# Altium project MCU063A.PrjPcb (part 5 of 5)

## Sheet MCU063A_Emulator.SchDoc
size 431 x 279 mm; Date: Not shown in title block; ApprovedBy: Not shown in title block; CheckedBy: Not shown in title block; Author: Not shown in title block; CompanyName: Not shown in title block; DrawnBy: Cody Watkins; Engineer: Not shown in title block; Organization: Not shown in title block; Address1: Not shown in title block; Address2: Not shown in title block; Address3: Not shown in title block; Address4: Not shown in title block; DocumentNumber: 9; Revision: Use project parameter SCH_Rev; SheetNumber: 9; SheetTotal: 11; PageSetup: Record=PageOptions|CenterHorizontal=True|CenterVertical=True|PrintScale=1.00|XCorrection=1.00|YCorrection=1.00|PrintKind=0|BorderSize=5000000|LeftOffset=0|BottomOffset=0|Orientation=2|PaperLength=1000|PaperWidth=1000|Scale=100|PaperSource=15|PrintQuality=600|MediaType=1|DitherType=10|PaperKind=Letter|PrintScaleMode=1; CurrentTime: Not shown in title block; CurrentDate: Not shown in title block; Time: Not shown in title block; DocumentFullPathAndName: Not shown in title block; DocumentName: Not shown in title block; ModifiedDate: Not shown in title block; ImagePath: Not shown in title block
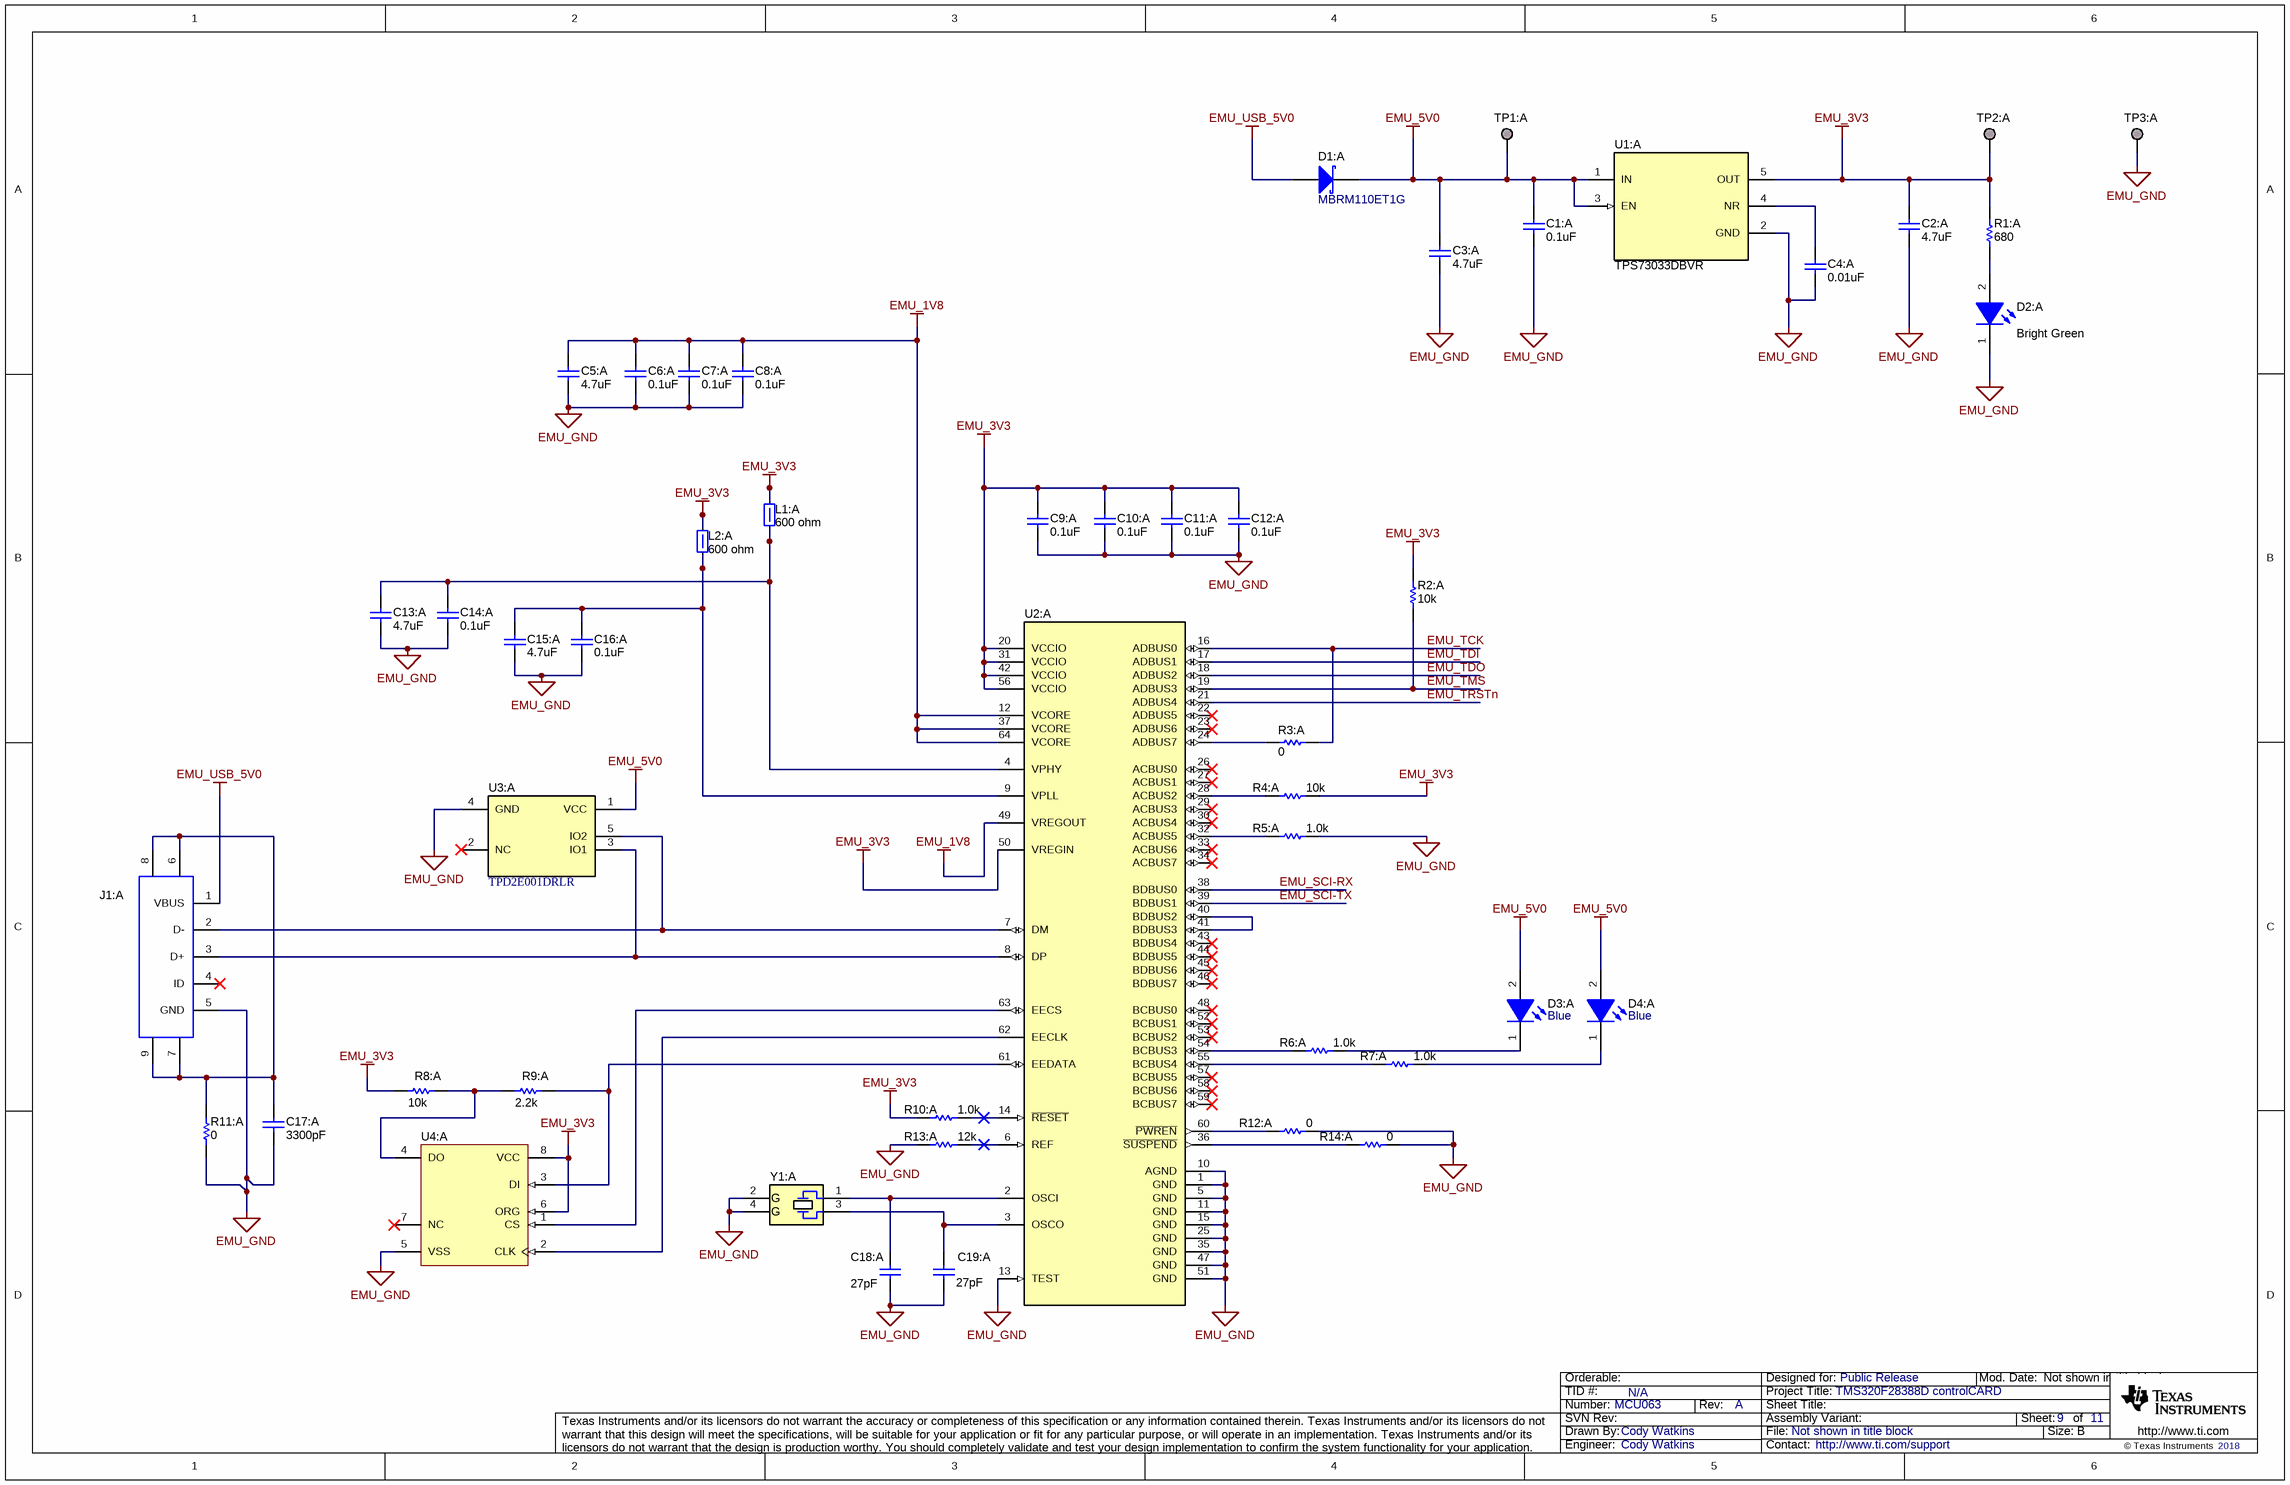
[diagram p8: MCU063A_Emulator.SchDoc]

### Parts
C1:A  ValueDisplayed: 0.1uF  [0402]  (hidden comment: CL05B104KP5NNNC)
C2:A  ValueDisplayed: 4.7uF  [0603]  (hidden comment: C0603C475K9PACTU)
C3:A  ValueDisplayed: 4.7uF  [0603]  (hidden comment: C0603C475K9PACTU)
C4:A  ValueDisplayed: 0.01uF  [0402]  (hidden comment: 0402ZC103KAT2A)
C5:A  ValueDisplayed: 4.7uF  [0603]  (hidden comment: C0603C475K9PACTU)
C6:A  ValueDisplayed: 0.1uF  [0402]  (hidden comment: CL05B104KP5NNNC)
C7:A  ValueDisplayed: 0.1uF  [0402]  (hidden comment: CL05B104KP5NNNC)
C8:A  ValueDisplayed: 0.1uF  [0402]  (hidden comment: CL05B104KP5NNNC)
C9:A  ValueDisplayed: 0.1uF  [0402]  (hidden comment: CL05B104KP5NNNC)
C10:A  ValueDisplayed: 0.1uF  [0402]  (hidden comment: CL05B104KP5NNNC)
C11:A  ValueDisplayed: 0.1uF  [0402]  (hidden comment: CL05B104KP5NNNC)
C12:A  ValueDisplayed: 0.1uF  [0402]  (hidden comment: CL05B104KP5NNNC)
C13:A  ValueDisplayed: 4.7uF  [0603]  (hidden comment: C0603C475K9PACTU)
C14:A  ValueDisplayed: 0.1uF  [0402]  (hidden comment: CL05B104KP5NNNC)
C15:A  ValueDisplayed: 4.7uF  [0603]  (hidden comment: C0603C475K9PACTU)
C16:A  ValueDisplayed: 0.1uF  [0402]  (hidden comment: CL05B104KP5NNNC)
C17:A  ValueDisplayed: 3300pF  [0402]  (hidden comment: CGA2B2X7R1H332K050BA)
C18:A  ValueDisplayed: 27pF  [0402]  (hidden comment: C0402C270J5GACTU)
C19:A  ValueDisplayed: 27pF  [0402]  (hidden comment: C0402C270J5GACTU)
D1:A  MBRM110ET1G  [POWERMITE]
D2:A  value Bright Green  [WL-SMCW_Green_0805]  (hidden comment: 150080VS75000)
D3:A  value Blue  [WL-SMCW_Blue_0805]  (hidden comment: 150080BS75000)
D4:A  value Blue  [WL-SMCW_Blue_0805]  (hidden comment: 150080BS75000)
J1:A  65100516121  [Wurth_65100516121]  (value not drawn)
L1:A  value 600 ohm  [0805_HV]  (hidden comment: HZ0805E601R-10)
L2:A  value 600 ohm  [0805_HV]  (hidden comment: HZ0805E601R-10)
R1:A  ValueDisplayed: 680  [0402]  (hidden comment: CRCW0402680RJNED)
R2:A  ValueDisplayed: 10k  [0402]  (hidden comment: CRCW040210K0JNED)
R3:A  ValueDisplayed: 0  [0402]  (hidden comment: CRCW04020000Z0ED)
R4:A  ValueDisplayed: 10k  [0402]  (hidden comment: CRCW040210K0JNED)
R5:A  ValueDisplayed: 1.0k  [0402]  (hidden comment: CRCW04021K00JNED)
R6:A  ValueDisplayed: 1.0k  [0402]  (hidden comment: CRCW04021K00JNED)
R7:A  ValueDisplayed: 1.0k  [0402]  (hidden comment: CRCW04021K00JNED)
R8:A  ValueDisplayed: 10k  [0402]  (hidden comment: CRCW040210K0JNED)
R9:A  ValueDisplayed: 2.2k  [0402]  (hidden comment: CRCW04022K20JNED)
R10:A  ValueDisplayed: 1.0k  [0402]  (hidden comment: CRCW04021K00JNED)
R11:A  ValueDisplayed: 0  [0402]  (hidden comment: CRCW04020000Z0ED)
R12:A  ValueDisplayed: 0  [0402]  (hidden comment: CRCW04020000Z0ED)
R13:A  ValueDisplayed: 12k  [0402]  (hidden comment: CRCW040212K0JNED)
R14:A  ValueDisplayed: 0  [0402]  (hidden comment: CRCW04020000Z0ED)
TP1:A  TESTPOINT  [TP_50MIL-25MILHOLE]  (value not drawn)  (no BOM)
TP2:A  TESTPOINT  [TP_50MIL-25MILHOLE]  (value not drawn)  (no BOM)
TP3:A  TESTPOINT  [TP_50MIL-25MILHOLE]  (value not drawn)  (no BOM)
U1:A  TPS73033DBVR  [DBV0005A_N]
U2:A  FT2232HL-REEL  [LQFP64_N]  (value not drawn)
U3:A  TPD2E001DRLR  [DRL0005A]
U4:A  93LC56C-I/SN  [SOIC-8]  (value not drawn)
Y1:A  ECS-120-20-30B-TR  [ECS_ECX-53B]  (value not drawn)

### Nets
EMU_1V8: C5:A.2 C6:A.2 C7:A.2 C8:A.2 U2:A.12(VCORE) U2:A.37(VCORE) U2:A.49(VREGOUT) U2:A.64(VCORE)
EMU_3V3: C2:A.1 C9:A.2 C10:A.2 C11:A.2 C12:A.2 L1:A.2 L2:A.2 R1:A.1 R2:A.2 R4:A.2 R8:A.1 R10:A.1 TP2:A.1 U1:A.5(OUT) U2:A.20(VCCIO) U2:A.31(VCCIO) U2:A.42(VCCIO) U2:A.50(VREGIN) U2:A.56(VCCIO) U4:A.6(ORG) U4:A.8(VCC)
EMU_5V0: C1:A.2 C3:A.1 D1:A.1(K) D3:A.2(A) D4:A.2(A) TP1:A.1 U1:A.1(IN) U1:A.3(EN) U3:A.1(VCC)
EMU_GND: C1:A.1 C2:A.2 C3:A.2 C4:A.1 C5:A.1 C6:A.1 C7:A.1 C8:A.1 C9:A.1 C10:A.1 C11:A.1 C12:A.1 C13:A.2 C14:A.1 C15:A.2 C16:A.1 C17:A.1 C18:A.1 C19:A.1 D2:A.1(K) J1:A.5(GND) R5:A.2 R11:A.2 R12:A.1 R13:A.1 R14:A.1 TP3:A.1 U1:A.2(GND) U2:A.1(GND) U2:A.5(GND) U2:A.10(AGND) U2:A.11(GND) U2:A.13(TEST) U2:A.15(GND) U2:A.25(GND) U2:A.35(GND) U2:A.47(GND) U2:A.51(GND) U3:A.4(GND) U4:A.5(VSS) Y1:A.2(GND) Y1:A.4(GND)
EMU_USB_5V0: D1:A.2(A) J1:A.1(VBUS)
EMU_SCI-RX: U2:A.38(BDBUS0)
EMU_SCI-TX: U2:A.39(BDBUS1)
EMU_TCK: R3:A.1 U2:A.16(ADBUS0)
EMU_TDI: U2:A.17(ADBUS1)
EMU_TDO: U2:A.18(ADBUS2)
EMU_TMS: R2:A.1 U2:A.19(ADBUS3)
EMU_TRSTn: U2:A.21(ADBUS4)
NetC4:A_2: C4:A.2 U1:A.4(NR)
NetC13:A_1: C13:A.1 C14:A.2 L1:A.1 U2:A.4(VPHY)
NetC15:A_1: C15:A.1 C16:A.2 L2:A.1 U2:A.9(VPLL)
NetC17:A_2: C17:A.2 J1:A.6 J1:A.7 J1:A.8 J1:A.9 R11:A.1
NetC18:A_2: C18:A.2 U2:A.2(OSCI) Y1:A.1
NetC19:A_2: C19:A.2 U2:A.3(OSCO) Y1:A.3
NetD2:A_2: D2:A.2(A) R1:A.2
NetD3:A_1: D3:A.1(K) R6:A.2
NetD4:A_1: D4:A.1(K) R7:A.2
NetJ1:A_2: J1:A.2(D-) U2:A.7(DM) U3:A.5(IO2)
NetJ1:A_3: J1:A.3(D+) U2:A.8(DP) U3:A.3(IO1)
NetR3:A_2: R3:A.2 U2:A.24(ADBUS7)
NetR4:A_1: R4:A.1 U2:A.28(ACBUS2)
NetR5:A_1: R5:A.1 U2:A.32(ACBUS5)
NetR6:A_1: R6:A.1 U2:A.54(BCBUS3)
NetR7:A_1: R7:A.1 U2:A.55(BCBUS4)
NetR8:A_2: R8:A.2 R9:A.1 U4:A.4(DO)
NetR9:A_2: R9:A.2 U2:A.61(EEDATA) U4:A.3(DI)
NetR10:A_2: R10:A.2 U2:A.14(~{RESET})
NetR12:A_2: R12:A.2 U2:A.60(~{PWREN})
NetR13:A_2: R13:A.2 U2:A.6(REF)
NetR14:A_2: R14:A.2 U2:A.36(~{SUSPEND})
NetU2:A_40: U2:A.40(BDBUS2) U2:A.41(BDBUS3)
NetU2:A_62: U2:A.62(EECLK) U4:A.2(CLK)
NetU2:A_63: U2:A.63(EECS) U4:A.1(CS)

Not connected (* = marked no-connect by the designer): J1:A 4(ID)*; U2:A 22(ADBUS5)* 23(ADBUS6)* 26(ACBUS0)* 27(ACBUS1)* 29(ACBUS3)* 30(ACBUS4)* 33(ACBUS6)* 34(ACBUS7)* 43(BDBUS4)* 44(BDBUS5)* 45(BDBUS6)* 46(BDBUS7)* 48(BCBUS0)* 52(BCBUS1)* 53(BCBUS2)* 57(BCBUS5)* 58(BCBUS6)* 59(BCBUS7)*; U3:A 2(NC)*; U4:A 7(NC)*

### Notes on the sheet
- Drawn By:
- SVN Rev:
- Number:
- TID #:
- Orderable:
- Rev:
- Sheet Title:
- File:
- Project Title:
- Designed for:
- Assembly Variant:
- Mod. Date:
- Sheet:
- Size:
- of
- B
- http://www.ti.com
- Texas Instruments and/or its licensors do not warrant the accuracy or completeness of this specification or any information contained therein. Texas Instruments and/or its licensors do not warrant that this design will meet the specifications, will be suitable for your application or fit for any particular purpose, or will operate in an implementation. Texas Instruments and/or its licensors do not warrant that the design is production worthy. You should completely validate and test your design implementation to confirm the system functionality for your application.
- Engineer:
- Contact:
- © Texas Instruments
- (in symbol CMP-0004646-3) G

### Library data of the parts
C1:A C6:A C7:A C8:A C9:A C10:A C11:A C12:A C14:A C16:A = CMP-0006343-2: CAP, CERM, 0.1 uF, 10 V, +/- 10%, X7R, 0402; Manufacturer: Samsung Electro-Mechanics; Polarized: N; Value: 0.1uF; U/M: EA; Cap_F: 100nF; Value1: Unknown; VDC_V: 10V; TaMin_C: -55°C; TaMax_C: 125°C; AEC Category: Q200; SizeArea_mm2: 0.5; SizeAreaWB_mm2: 3; SizeX_mm: 1; SizeZ_mm: 0.6; CompType: Capacitor; PartNumber: CL05B104KP5NNNC; PackageReference: 0402; RoHS: Y; Tolerance_%: 10%; Value2: 10V; MountType: SMT; Technology: Ceramic; TempCo: X7R; Cap_Case: 0402; Published: 2008-06-19; Publisher: Texas Instruments; LatestRevisionDate: 2017-03-09; ComponentLink1Description: Datasheet link; ComponentLink1URL: http://www.samsungsem.com/kr/front/downloadcms.do?path=/kr/support/product-search/mlcc/__icsFiles/afieldfile/2014/11/05&fileName=S_CL05B104KP5NNNC.pdf; AEC Qualified: N; AEC Grade: N/A; SizeY_mm: 0.5
C2:A C3:A C5:A C13:A C15:A = CMP-0006950-5: CAP, CERM, 4.7 uF, 6.3 V, +/- 10%, X5R, 0603; Manufacturer: Kemet; TaMin_C: -55°C; ESR_ohm: 6m; Polarized: N; SizeAreaWB_mm2: 4.68; Value1: 0.006 ohm; U/M: EA; Value: 4.7uF; TaMax_C: 85°C; SizeZ_mm: 1; SizeX_mm: 1.6; SizeY_mm: 0.8; Value2: 6.3V; SizeArea_mm2: 1.28; Cap_F: 4.7µF; IRMS_A: 7.24A; AEC Category: Q200; Supplier Part Number 2: 80-C0603C475K9P; Publisher: Texas Instruments; Supplier 2: Mouser; Supplier Part Number 3: 9227784; TempCo: X5R; Supplier 3: Farnell; Published: 2008-06-19; RoHS: Y; MountType: SMT; Supplier 1: Digi-Key; PackageReference: 0603; Tolerance_%: 10%; Cap_Case: 0603; CompType: Capacitor; LatestRevisionDate: 2017-03-09; PartNumber: C0603C475K9PACTU; AEC Qualified: ?; ComponentLink1Description: Datasheet link; Supplier Part Number 1: 399-3482-1-ND; Technology: Ceramic; ComponentLink1URL: http://www.kemet.com/kemet/web/homepage/kechome.nsf/vapubfiles/F3102_Y5V.pdf/$file/F3102_Y5V.pdf
C4:A = CMP-0006203-2: CAP, CERM, 0.01 uF, 10 V, +/- 10%, X7R, 0402; Manufacturer: AVX; Polarized: N; Value: 0.01uF; U/M: EA; Cap_F: 10nF; Value1: Unknown; Value2: 10V; TaMin_C: -55°C; TaMax_C: 125°C; AEC Category: Q200; SizeArea_mm2: 0.5; SizeAreaWB_mm2: 3; SizeX_mm: 1; SizeZ_mm: 0.6; CompType: Capacitor; PartNumber: 0402ZC103KAT2A; PackageReference: 0402; RoHS: Y; Tolerance_%: 10%; MountType: SMT; Technology: Ceramic; TempCo: X7R; Cap_Case: 0402; Published: 2008-06-19; Publisher: Texas Instruments; LatestRevisionDate: 2017-03-09; ComponentLink1Description: Datasheet link; ComponentLink1URL: http://datasheets.avx.com/X7RDielectric.pdf; Supplier 1: Digi-Key; Supplier Part Number 1: 478-7890-1-ND; Supplier 2: Newark; Supplier Part Number 2: 94W2829; Supplier 3: Mouser; Supplier Part Number 3: 581-0402ZC103KAT2A; AEC Qualified: N; AEC Grade: N/A; SizeY_mm: 0.5
C17:A = CMP-0006319-2: CAP, CERM, 3300 pF, 50 V, +/- 10%, X7R, AEC-Q200 Grade 1, 0402; Manufacturer: TDK; TaMin_C: -55°C; ESR_ohm: 7.85178d; Polarized: N; SizeAreaWB_mm2: 3; Value1: 0.785178 ohm; U/M: EA; Value: 3300pF; TaMax_C: 125°C; SizeZ_mm: 0.6; SizeX_mm: 1; SizeY_mm: 0.5; Value2: 50V; AEC Qualified: Y; Cap_F: 3.3nF; IRMS_A: 2.72902dA; AEC Category: Q200; Supplier Part Number 2: 810-CGA2B2X7R1H332K050BA; Publisher: Texas Instruments; Supplier 2: Mouser; TempCo: X7R; Published: 2008-06-19; RoHS: Y; MountType: SMT; Supplier 1: Digi-Key; PackageReference: 0402; Tolerance_%: 10%; Cap_Case: 0402; SizeArea_mm2: 0.5; CompType: Capacitor; LatestRevisionDate: 2017-03-09; PartNumber: CGA2B2X7R1H332K050BA; ComponentLink1Description: Datasheet link; AEC Grade: 1; Supplier Part Number 1: 445-6891-1-ND; Technology: Ceramic; ComponentLink1URL: https://product.tdk.com/en/search/capacitor/ceramic/mlcc/info?part_no=CGA2B2X7R1H332K050BA
C18:A C19:A = CMP-0750098-1: CAP, CERM, 27 pF, 50 V,+/- 5%, C0G/NP0, 0402; Manufacturer: Kemet; SizeX_mm: 1; TaMin_C: -55°C; Value: 27pF; Polarized: N; SizeAreaWB_mm2: 3; SizeArea_mm2: 0.5; Green_REACh: Passed; Green_Lifecycle: Active; Value2: 50V; U/M: EA; AEC Category: Q200; SizeZ_mm: 0.6; TaMax_C: 125°C; PartNumber: C0402C270J5GACTU; Tolerance_%: 5%; Cap_F: 27pF; Cap_Case: 0402; Technology: Ceramic; RoHS: Y; ComponentLink1Description: Datasheet link; TempCo: C0G/NP0; PackageReference: 0402; ComponentLink1URL: https://content.kemet.com/datasheets/KEM_C1003_C0G_SMD.pdf; SizeY_mm: 0.5; Green_EU RoHS: Passed; CompType: Capacitor; MountType: SMT; Green_EU RoHS-2: Passed; AEC Qualified: N; AEC Grade: N/A
D1:A = CMP-0028747-2: Diode, Schottky, 10 V, 1 A, AEC-Q101, POWERMITE; Manufacturer: ON Semiconductor; Vf_V: 530mV; Value: 10V; Value1: 1A; Value2: 0.53V; TJmax_C: 150°C; AEC Category: Q101; AEC Qualified: Y; SizeAreaWB_mm2: 14.945; SizeArea_mm2: 7.995; SizeX_mm: 3.9; SizeY_mm: 2.05; SizeZ_mm: 1.15; Green_Lifecycle: Not Set; Green_REACh: Incomplete; CompType: Diode; PartNumber: MBRM110ET1G; PackageReference: POWERMITE; Io_A: 1A; Vr_V: 10V; MountType: SMT; Type: Schottky; RoHS: Y; ComponentLink1Description: Datasheet link; ComponentLink1URL: http://www.onsemi.com/pub_link/Collateral/MBRM110E-D.PDF; Green_EU RoHS-2: Incomplete; Green_EU RoHS: Incomplete
D2:A = CMP-0002960-2: LED, Bright Green, SMD; Manufacturer: Wurth Elektronik; Type: AlInGaP; Vf_V: 2V; Io_A: 20mA; Vr_V: 5V; Tjmax_C: 85°C; Power_TotalModule: 72mW; Value1: 0.072W; Angle: 140; U/M: EA; PartNumber: 150080VS75000; PackageReference: LED_0805; RoHS: Y; CompType: LED; MountType: SMT; Value2: 2V; Color: Bright Green; Published: 2008-07-11; Publisher: Texas Instruments; ComponentLink1URL: http://katalog.we-online.de/led/datasheet/150080VS75000.pdf; ComponentLink1Description: Datasheet link; LatestRevisionDate: 2017-03-09; Supplier 1: Digi-Key; Supplier Part Number 1: 732-4986-1-ND; Supplier 2: Newark; Supplier Part Number 2: 95W3803; Supplier 3: Mouser; Supplier Part Number 3: 710-150080VS75000
D3:A D4:A = CMP-0002959-3: LED, Blue, SMD; Manufacturer: Wurth Elektronik; Vf_V: 3.2V; Value1: 0.105W; Angle: 140; Type: InGaN; Power_TotalModule: 105mW; Tjmax_C: 85°C; Vr_V: 5V; Io_A: 20mA; ComponentLink1URL: http://katalog.we-online.de/led/datasheet/150080BS75000.pdf; RoHS: Y; Color: Blue; MountType: SMT; Value2: 3.2V; ComponentLink1Description: Datasheet link; CompType: LED; PartNumber: 150080BS75000; PackageReference: LED_0805
J1:A = CMP-0054809-1: Connector, Receptacle, USB Mini B 2.0, SMT; Manufacturer: Wurth Elektronik; Pitch_mm: 0.8; Gender: Female; Row_Count: 1; ContactFinish: Gold; Current_A: 1A; Voltage_V: 30V; Cert_UL: Y; CNHeader: FALSE; CT: TRUE; Green_Lifecycle: Active; Green_REACh: Passed; PartNumber: 65100516121; PackageReference: Connector, Receptacle, USB Mini B 2.0, 5 Position, SMT; CompType: USB; RoHS: Y; MountType: SMT; ComponentLink1Description: Datasheet URL; ComponentLink1URL: http://katalog.we-online.de/em/datasheet/65100516121.pdf; Publisher: Texas Instruments; LatestRevisionDate: 26/05/2017; Supplier 1: Digi-Key; Supplier Part Number 1: 732-2109-1-ND; Supplier 2: Newark; Supplier Part Number 2: 19P1304; Supplier 3: Mouser; Supplier Part Number 3: 710-65100516121; Orientation: R/A; PinCount: 5; Color: Black; Cert_CULUS: Y; Green_EU RoHS-2: Incomplete; Green_EU RoHS: Passed
L1:A L2:A = CMP-0003398-1: Ferrite Bead, 600 ohm @ 100 MHz, 0.5 A, 0805; Manufacturer: Laird-Signal Integrity Products; Imax_A: 5dA; DCR_ohm: 3d; Value1: 0.3 ohm; Value2: 0.5A; ZTyp@100MHz_Ohm: 600; SizeArea_mm2: 2.5; SizeAreaWB_mm2: 6.75; SizeX_mm: 2; SizeY_mm: 1.25; SizeZ_mm: 1.45; CompType: Ferrite Bead; PartNumber: HZ0805E601R-10; MountType: SMT; PackageReference: 0805; Published: 2014-04-30; Publisher: Texas Instruments; LatestRevisionDate: 2017-03-09; ComponentLink1Description: Datasheet link; ComponentLink1URL: http://www.lairdtech.com/WorkArea/linkit.aspx?linkIdentifier=id&ItemID=4884; RoHS: Y; Supplier 1: Digi-Key; Supplier Part Number 1: 240-2399-1-ND; Supplier 2: Newark; Supplier Part Number 2: 66W8909; Supplier 3: Mouser; Supplier Part Number 3: 875-HZ0805E601R-10; ValueDisplayed: 600 ohm
R1:A = CMP-0026962-3: RES, 680, 5%, 0.063 W, AEC-Q200 Grade 0, 0402; Manufacturer: Vishay-Dale; Value: 680; Value_Code: 680R; Power_W: 63mW; Value2: 0.063W; VDC_V: 50V; TempCo: 200 ppm/C; EIA_Code: E24; AEC Category: Q200; AEC Qualified: Y; AEC Grade: 0; SizeArea_mm2: 0.5; SizeX_mm: 1; SizeZ_mm: 0.6; CompType: Resistor; PartNumber: CRCW0402680RJNED; PackageReference: 0402; RoHS: E; Res_ohm: 680; Tolerance_%: 5%; Value1: 5%; MountType: SMT; Technology: Thick Film; ComponentLink1Description: Datasheet link; ComponentLink1URL: http://www.vishay.com/docs/20035/dcrcwe3.pdf; Supplier 1: Digi-Key; Supplier Part Number 1: 541-680JCT-ND; Supplier 2: Newark; Supplier Part Number 2: 59M6744; Supplier 3: Mouser; Supplier Part Number 3: 71-CRCW0402J-680-E3; SizeY_mm: 0.5
R2:A R4:A R8:A = CMP-0026825-5: RES, 10 k, 5%, 0.063 W, AEC-Q200 Grade 0, 0402; Manufacturer: Vishay-Dale; Value: 10k; Value_Code: 10k0; Power_W: 63mW; Value2: 0.063W; VDC_V: 50V; TempCo: 200 ppm/C; EIA_Code: E24; AEC Category: Q200; AEC Qualified: Y; AEC Grade: 0; SizeArea_mm2: 0.5; SizeX_mm: 1; SizeZ_mm: 0.6; CompType: Resistor; PartNumber: CRCW040210K0JNED; PackageReference: 0402; RoHS: E; Res_ohm: 10k; Tolerance_%: 5%; Value1: 5%; MountType: SMT; Technology: Thick Film; ComponentLink1Description: Datasheet link; ComponentLink1URL: http://www.vishay.com/docs/20035/dcrcwe3.pdf; Supplier 1: Digi-Key; Supplier Part Number 1: 541-10KJCT-ND; Supplier 2: Newark; Supplier Part Number 2: 59M6696; Supplier 3: Mouser; Supplier Part Number 3: 71-CRCW0402J-10K-E3; SizeY_mm: 0.5
R3:A R11:A R12:A R14:A = CMP-0026822-3: RES, 0, 5%, 0.063 W, AEC-Q200 Grade 0, 0402; Manufacturer: Vishay-Dale; Value: 0; Value_Code: 0000; Power_W: 63mW; Value2: 0.063W; VDC_V: 50V; TempCo: 200 ppm/C; EIA_Code: E24; AEC Category: Q200; AEC Qualified: Y; SizeArea_mm2: 0.5; SizeX_mm: 1; SizeZ_mm: 0.6; CompType: Resistor; PartNumber: CRCW04020000Z0ED; PackageReference: 0402; RoHS: E; Res_ohm: 0; Tolerance_%: 5%; Value1: 5%; MountType: SMT; Technology: Thick Film; ComponentLink1Description: Datasheet link; ComponentLink1URL: http://www.vishay.com/docs/20035/dcrcwe3.pdf; Supplier 1: Digi-Key; Supplier Part Number 1: 541-0.0JCT-ND; Supplier 2: Newark; Supplier Part Number 2: 52K6543; Supplier 3: Mouser; Supplier Part Number 3: 71-CRCW0402-0-E3; AEC Grade: 0; SizeY_mm: 0.5
R5:A R6:A R7:A R10:A = CMP-0026852-3: RES, 1.0 k, 5%, 0.063 W, AEC-Q200 Grade 0, 0402; Manufacturer: Vishay-Dale; Value: 1.0k; Res_ohm: 1k; Value_Code: 1k00; Power_W: 63mW; Value2: 0.063W; VDC_V: 50V; TempCo: 200 ppm/C; EIA_Code: E24; AEC Category: Q200; AEC Qualified: Y; AEC Grade: 0; SizeArea_mm2: 0.5; SizeX_mm: 1; SizeZ_mm: 0.6; CompType: Resistor; PartNumber: CRCW04021K00JNED; PackageReference: 0402; RoHS: E; Tolerance_%: 5%; Value1: 5%; MountType: SMT; Technology: Thick Film; ComponentLink1Description: Datasheet link; ComponentLink1URL: http://www.vishay.com/docs/20035/dcrcwe3.pdf; Supplier 1: Digi-Key; Supplier Part Number 1: 541-1.0KJCT-ND; Supplier 2: Newark; Supplier Part Number 2: 59M6691; Supplier 3: Mouser; Supplier Part Number 3: 71-CRCW0402J-1.0K-E3; SizeY_mm: 0.5
R9:A = CMP-0026890-5: RES, 2.2 k, 5%, 0.063 W, AEC-Q200 Grade 0, 0402; Manufacturer: Vishay-Dale; Value: 2.2k; Value_Code: 2k20; Power_W: 63mW; Value2: 0.063W; VDC_V: 50V; TempCo: 200 ppm/C; EIA_Code: E24; AEC Category: Q200; AEC Qualified: Y; AEC Grade: 0; SizeArea_mm2: 0.5; SizeX_mm: 1; SizeZ_mm: 0.6; CompType: Resistor; PartNumber: CRCW04022K20JNED; PackageReference: 0402; RoHS: E; Res_ohm: 2.2k; Tolerance_%: 5%; Value1: 5%; MountType: SMT; Technology: Thick Film; ComponentLink1Description: Datasheet link; ComponentLink1URL: http://www.vishay.com/docs/20035/dcrcwe3.pdf; Supplier 1: Digi-Key; Supplier Part Number 1: 541-2.2KJCT-ND; Supplier 2: Newark; Supplier Part Number 2: 59M6710; Supplier 3: Mouser; Supplier Part Number 3: 71-CRCW0402J-2.2K-E3; SizeY_mm: 0.5
R13:A = CMP-0026834-3: RES, 12 k, 5%, 0.063 W, AEC-Q200 Grade 0, 0402; Manufacturer: Vishay-Dale; Value: 12k; Value_Code: 12k0; Power_W: 63mW; Value2: 0.063W; VDC_V: 50V; TempCo: 200 ppm/C; EIA_Code: E24; AEC Category: Q200; AEC Qualified: Y; AEC Grade: 0; SizeArea_mm2: 0.5; SizeX_mm: 1; SizeZ_mm: 0.6; CompType: Resistor; PartNumber: CRCW040212K0JNED; PackageReference: 0402; RoHS: E; Res_ohm: 12k; Tolerance_%: 5%; Value1: 5%; MountType: SMT; Technology: Thick Film; ComponentLink1Description: Datasheet link; ComponentLink1URL: http://www.vishay.com/docs/20035/dcrcwe3.pdf; Supplier 1: Digi-Key; Supplier Part Number 1: 541-12KJCT-ND; Supplier 2: Newark; Supplier Part Number 2: 89M6603; Supplier 3: Mouser; Supplier Part Number 3: 71-CRCW040212K0JNED; SizeY_mm: 0.5
TP1:A TP2:A TP3:A = CMP-0078143-2: TEST POINT.  No entry in BOM.; CompType: Testpoint; PackageReference: N/A; Manufacturer: N/A; PartNumber: N/A; Library Reference: TESTPOINT
U1:A = CMP-0073823-1: Low-Noise, High PSRR, RF 200-mA Low-Dropout Linear Regulators, DBV0005A (SOT-23-5); Alternate PartNumber: TPS73033DBVT; Manufacturer: Texas Instruments; CompType: IC; U/M: EA; SizeArea_mm2: 8.12; SizeAreaWB_mm2: 14.82; SizeX_mm: 2.8; SizeY_mm: 2.9; SizeZ_mm: 1.45; Green_Lifecycle: Active; Green_REACh: Passed; PartNumber: TPS73033DBVR; PackageReference: DBV0005A; MountType: SMT; ComponentLink1Description: Datasheet Link; ComponentLink1URL: http://www.ti.com/lit/ds/symlink/tps730.pdf; RoHS: Y; Publisher: Texas Instruments; LatestRevisionDate: 2017-06-09; Alternate Manufacturer: Texas Instruments; PackageDescription: SOT-23-5; Footprint Path 6: C:\AltiumLibraries\Footprints\TI\.PcbLib; Green_EU RoHS-2: Passed; Green_EU RoHS: Passed
U2:A = CMP-0004796-1: Dual High Speed USB To Multipurpose UART/FIFO IC, LQFP-64; Manufacturer: FTDI; PartNumber: FT2232HL-REEL; MountType: SMT; ComponentLink1Description: Datasheet URL; ComponentLink1URL: http://www.ftdichip.com/Support/Documents/DataSheets/ICs/DS_FT2232H.pdf; RoHS: Y; PackageReference: LQFP_10x10mm; Publisher: Texas Instruments; LatestRevisionDate: 09/03/2017; Supplier 1: Digi-Key; Supplier Part Number 1: 768-1024-1-ND; Supplier 2: Mouser; Supplier Part Number 2: 895-FT2232HL
U3:A = CMP-0043096-2: Low-Capacitance + / - 15 kV ESD-Protection Array for High-Speed Data Interfaces, 2 Channels, -40 to +85 degC, 5-pin SOT (DRL), Green (RoHS & no Sb/Br); Manufacturer: Texas Instruments; Breakdown Voltage(Min)(V): 11; IEC 61000-4-2 Air-Gap(+/- kV): 15; IEC 61000-4-2 Contact(+/- kV): 8; IO Capacitance(Typ)(pF): 1.5; IO Leakage Current(nA): 1; SubFamily: ESD Solution; USB High Speed: TRUE; DatasheetVersion: SLLS684F; PackageVersion: revD, Aug-2007; PackageReference: DRL0005A; PackageDescription: 5-Pin Plastic Small Outline, Flat Lead 0.5 mm Pitch; Eco-Plan: Green (RoHS & no Sb/Br); PartNumber: TPD2E001DRLR; ComponentLink1Description: Manufacturer URL; ComponentLink1URL: http://www.ti.com/; ComponentLink2Description: Datasheet; ComponentLink2URL: http://www.ti.com/general/docs/lit/getliterature.tsp?genericPartNumber=TPD2E001&fileType=pdf; ComponentLink3Description: URL Link1; ComponentLink3URL: SamplesURL:http://www.ti.com/product/tpd2e001#samples; Mounting Technology: Surface Mount
U4:A = CMP-0005261-2: 2K Microwire Compatible Serial EEPROM, SOIC-8; Manufacturer: Microchip; SizeAreaWB_mm2: 55.131; SizeArea_mm2: 29.351; SizeX_mm: 5.99; SizeY_mm: 4.9; SizeZ_mm: 1.75; PartNumber: 93LC56C-I/SN; MountType: SMT; ComponentLink1Description: Datasheet URL; ComponentLink1URL: http://ww1.microchip.com/downloads/en/DeviceDoc/21794G.pdf; RoHS: Y; PackageReference: SOIC-8; Publisher: Texas Instruments; LatestRevisionDate: 09/03/2017; Supplier 1: Digi-Key; Supplier Part Number 1: 93LC56C-I/SN-ND; Supplier 2: Newark; Supplier Part Number 2: 30H4775; Supplier 3: Mouser; Supplier Part Number 3: 579-93LC56C-I/SNG
Y1:A = CMP-0004646-3: Crystal, 12 MHz, 20pF, SMD; Manufacturer: ECS Inc.; TaMin_C: -20°C; TaMax_C: 70°C; Frequency Stability: +/-50ppm; Frequency_Fixed: 12MHz; PartNumber: ECS-120-20-30B-TR; CompType: Crystal; PackageReference: 5x3.2mm; MountType: SMT; RoHS: Y; ComponentLink1Description: Datasheet Link; ComponentLink1URL: http://www.ecsxtal.com/store/pdf/ecx_53b.pdf; Supplier 1: Digi-Key; Supplier Part Number 1: XC1118CT-ND; Supplier 2: Mouser; Supplier Part Number 2: 520-ECS-120-20-30B

## Sheet MCU063A_Emulator_interface.SchDoc
size 431 x 279 mm; Date: Not shown in title block; ApprovedBy: Not shown in title block; CheckedBy: Not shown in title block; Author: Not shown in title block; CompanyName: Not shown in title block; DrawnBy: Cody Watkins; Engineer: Not shown in title block; Organization: Not shown in title block; Address1: Not shown in title block; Address2: Not shown in title block; Address3: Not shown in title block; Address4: Not shown in title block; DocumentNumber: 10; Revision: Use project parameter SCH_Rev; SheetNumber: 10; SheetTotal: 11; PageSetup: Record=PageOptions|CenterHorizontal=True|CenterVertical=True|PrintScale=1.00|XCorrection=1.00|YCorrection=1.00|PrintKind=0|BorderSize=5000000|LeftOffset=0|BottomOffset=0|Orientation=2|PaperLength=1000|PaperWidth=1000|Scale=100|PaperSource=15|PrintQuality=600|MediaType=1|DitherType=10|PaperKind=Letter|PrintScaleMode=1; CurrentTime: Not shown in title block; CurrentDate: Not shown in title block; Time: Not shown in title block; DocumentFullPathAndName: Not shown in title block; DocumentName: Not shown in title block; ModifiedDate: Not shown in title block; ImagePath: Not shown in title block
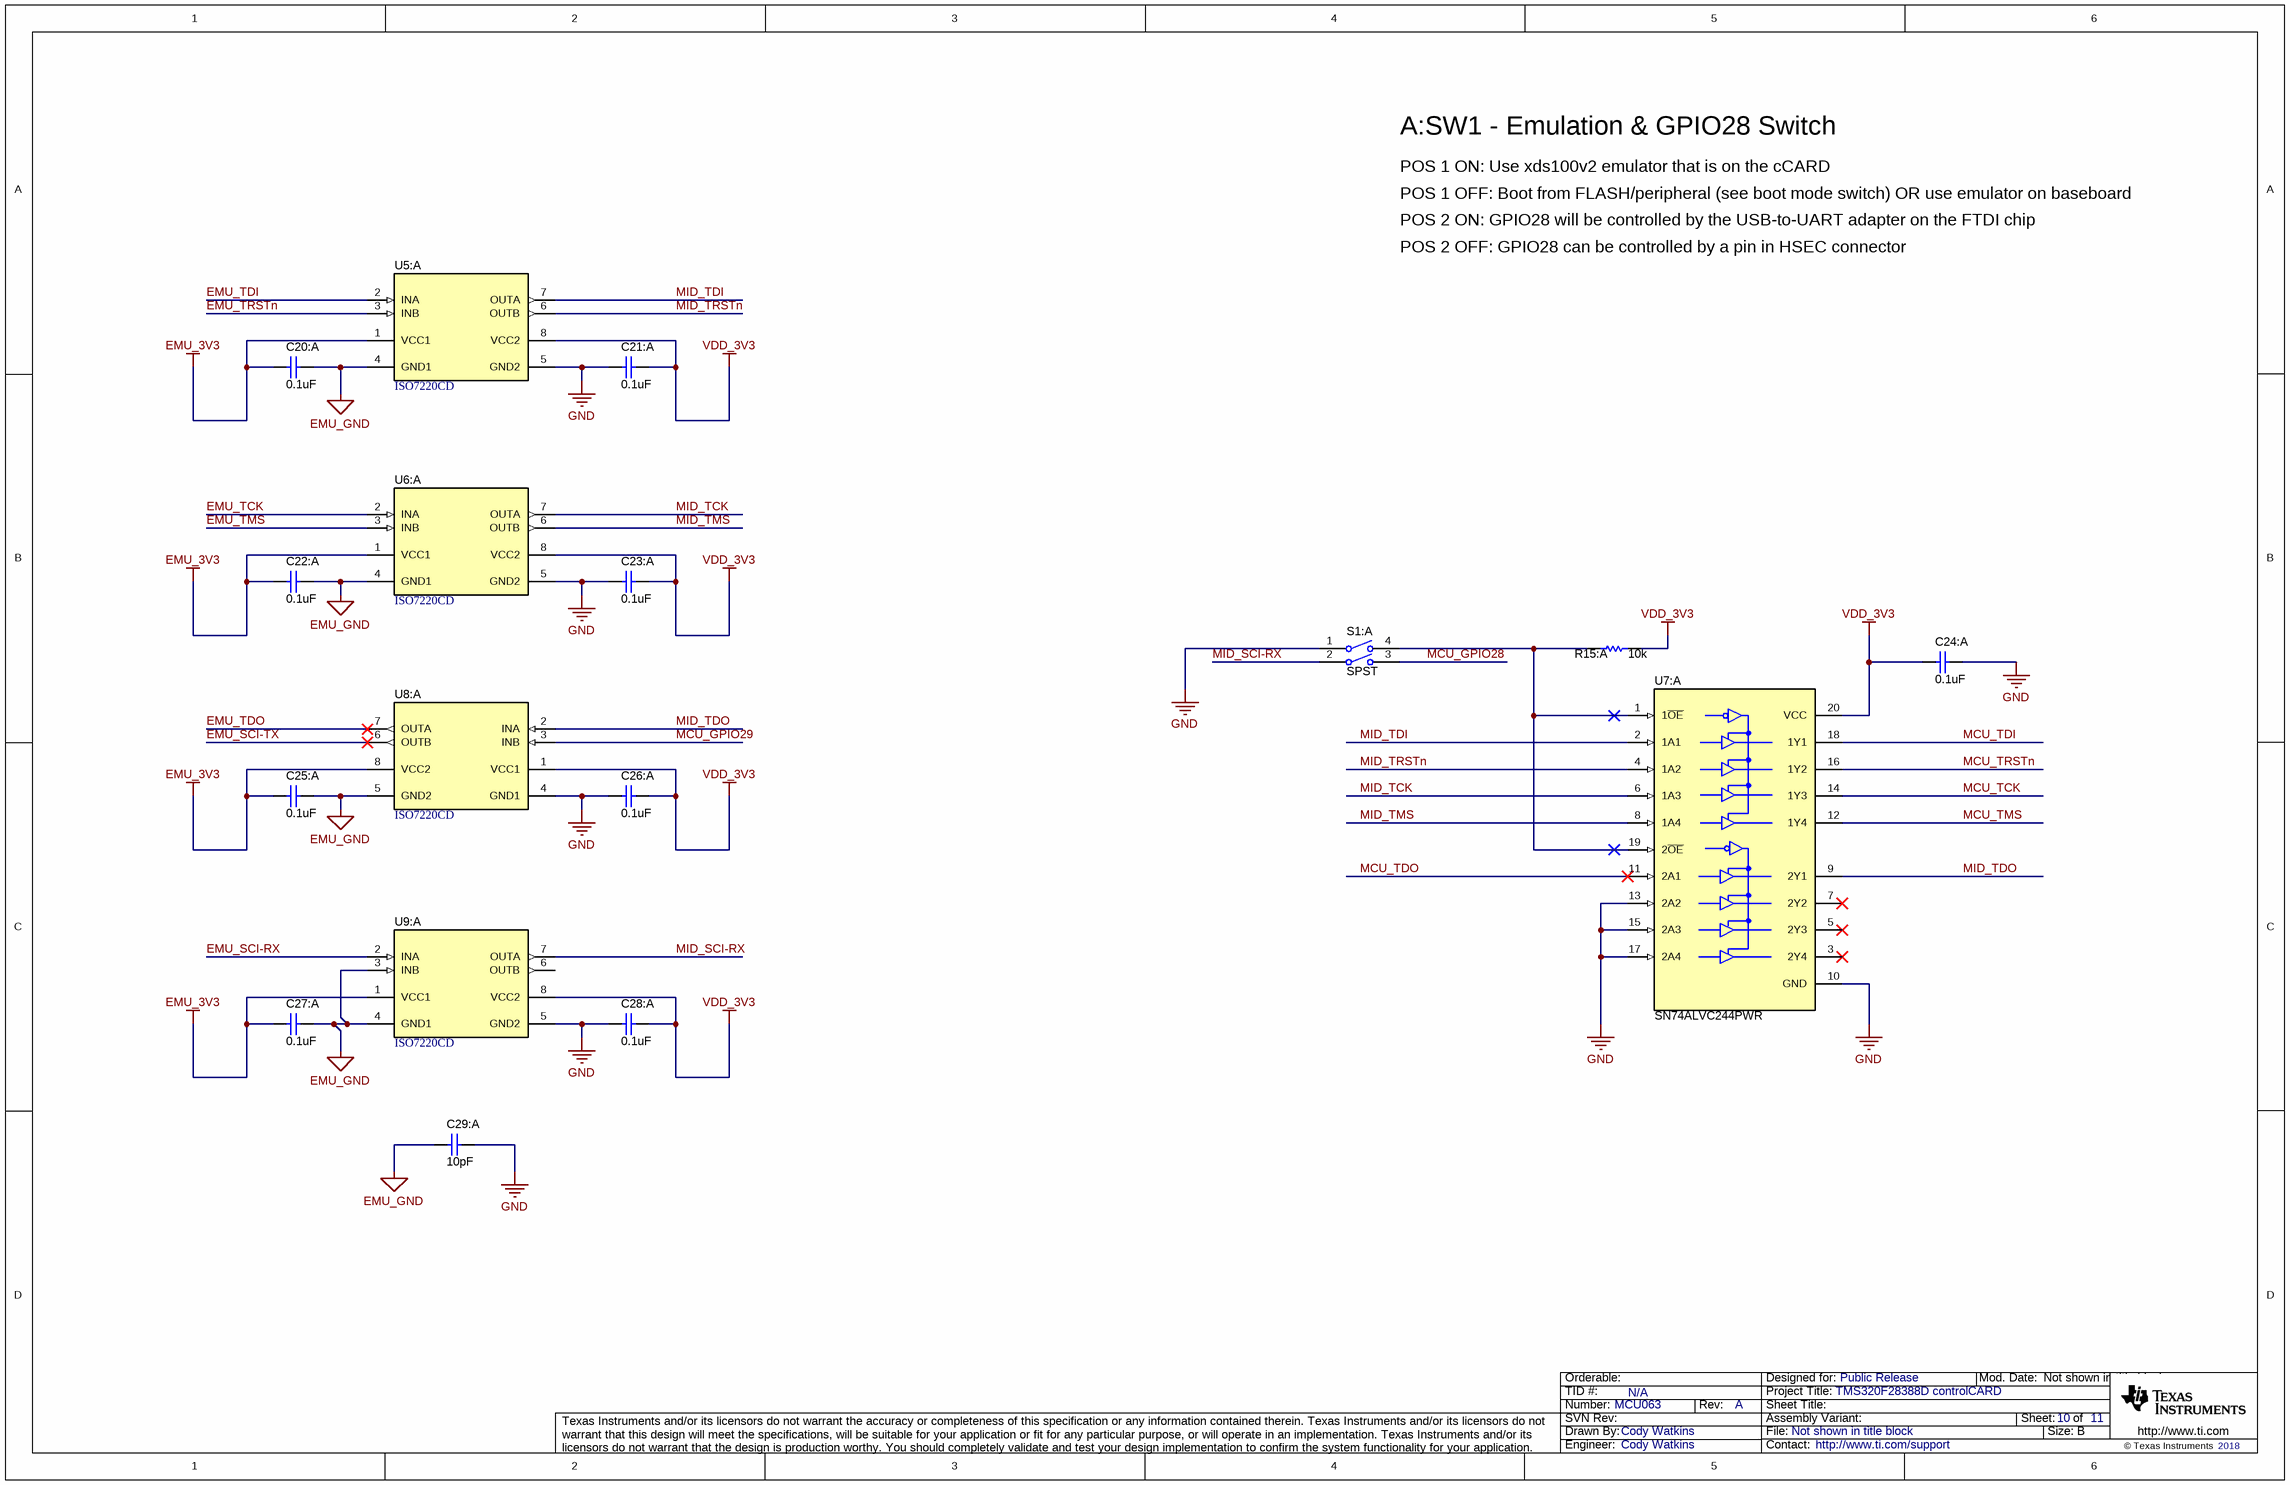
[diagram p9: MCU063A_Emulator_interface.SchDoc]

### Parts
C20:A  ValueDisplayed: 0.1uF  [0402]  (hidden comment: CL05B104KP5NNNC)
C21:A  ValueDisplayed: 0.1uF  [0402]  (hidden comment: CL05B104KP5NNNC)
C22:A  ValueDisplayed: 0.1uF  [0402]  (hidden comment: CL05B104KP5NNNC)
C23:A  ValueDisplayed: 0.1uF  [0402]  (hidden comment: CL05B104KP5NNNC)
C24:A  ValueDisplayed: 0.1uF  [0402]  (hidden comment: CL05B104KP5NNNC)
C25:A  ValueDisplayed: 0.1uF  [0402]  (hidden comment: CL05B104KP5NNNC)
C26:A  ValueDisplayed: 0.1uF  [0402]  (hidden comment: CL05B104KP5NNNC)
C27:A  ValueDisplayed: 0.1uF  [0402]  (hidden comment: CL05B104KP5NNNC)
C28:A  ValueDisplayed: 0.1uF  [0402]  (hidden comment: CL05B104KP5NNNC)
C29:A  ValueDisplayed: 10pF  [1812_180]  (hidden comment: C1812C100JHGACTU)
R15:A  ValueDisplayed: 10k  [0402]  (hidden comment: CRCW040210K0JNED)
S1:A  Circuit: SPST  [SW_218-2LP]  (hidden comment: 218-2LPST)
U5:A  ISO7220CD  [D0008B_N]
U6:A  ISO7220CD  [D0008B_N]
U7:A  SN74ALVC244PWR  [PW0020A_N]
U8:A  ISO7220CD  [D0008B_N]
U9:A  ISO7220CD  [D0008B_N]

### Nets
EMU_3V3: C20:A.2 C22:A.2 C25:A.2 C27:A.2 U5:A.1(VCC1) U6:A.1(VCC1) U8:A.8(VCC2) U9:A.1(VCC1)
EMU_GND: C20:A.1 C22:A.1 C25:A.1 C27:A.1 C29:A.2 U5:A.4(GND1) U6:A.4(GND1) U8:A.5(GND2) U9:A.3(INB) U9:A.4(GND1)
GND: C21:A.2 C23:A.2 C24:A.1 C26:A.2 C28:A.2 C29:A.1 S1:A.1 U5:A.5(GND2) U6:A.5(GND2) U7:A.10(GND) U7:A.13(2A2) U7:A.15(2A3) U7:A.17(2A4) U8:A.4(GND1) U9:A.5(GND2)
VDD_3V3: C21:A.1 C23:A.1 C24:A.2 C26:A.1 C28:A.1 R15:A.2 U5:A.8(VCC2) U6:A.8(VCC2) U7:A.20(VCC) U8:A.1(VCC1) U9:A.8(VCC2)
EMU_SCI-RX: U9:A.2(INA)
EMU_SCI-TX: U8:A.6(OUTB)
EMU_TCK: U6:A.2(INA)
EMU_TDI: U5:A.2(INA)
EMU_TDO: U8:A.7(OUTA)
EMU_TMS: U6:A.3(INB)
EMU_TRSTn: U5:A.3(INB)
MCU_GPIO28: S1:A.3
MCU_GPIO29: U8:A.3(INB)
MCU_TCK: U7:A.14(1Y3)
MCU_TDI: U7:A.18(1Y1)
MCU_TDO: U7:A.11(2A1)
MCU_TMS: U7:A.12(1Y4)
MCU_TRSTn: U7:A.16(1Y2)
MID_SCI-RX: S1:A.2 U9:A.7(OUTA)
MID_TCK: U6:A.7(OUTA) U7:A.6(1A3)
MID_TDI: U5:A.7(OUTA) U7:A.2(1A1)
MID_TDO: U7:A.9(2Y1) U8:A.2(INA)
MID_TMS: U6:A.6(OUTB) U7:A.8(1A4)
MID_TRSTn: U5:A.6(OUTB) U7:A.4(1A2)
NetR15:A_1: R15:A.1 S1:A.4 U7:A.1(1~{OE}) U7:A.19(2~{OE})

Not connected (* = marked no-connect by the designer): U7:A 3(2Y4)* 5(2Y3)* 7(2Y2)*; U9:A 6(OUTB)

### Notes on the sheet
- A:SW1 - Emulation & GPIO28 Switch
- POS 1 ON: Use xds100v2 emulator that is on the cCARD
- POS 1 OFF: Boot from FLASH/peripheral (see boot mode switch) OR use emulator on baseboard
- POS 2 ON: GPIO28 will be controlled by the USB-to-UART adapter on the FTDI chip
- POS 2 OFF: GPIO28 can be controlled by a pin in HSEC connector
- Drawn By:
- SVN Rev:
- Number:
- TID #:
- Orderable:
- Rev:
- Sheet Title:
- File:
- Project Title:
- Designed for:
- Assembly Variant:
- Mod. Date:
- Sheet:
- Size:
- of
- B
- http://www.ti.com
- Texas Instruments and/or its licensors do not warrant the accuracy or completeness of this specification or any information contained therein. Texas Instruments and/or its licensors do not warrant that this design will meet the specifications, will be suitable for your application or fit for any particular purpose, or will operate in an implementation. Texas Instruments and/or its licensors do not warrant that the design is production worthy. You should completely validate and test your design implementation to confirm the system functionality for your application.
- Engineer:
- Contact:
- © Texas Instruments

### Library data of the parts
C20:A C21:A C22:A C23:A C24:A C25:A C26:A C27:A C28:A = CMP-0006343-2: as C1:A on sheet MCU063A_Emulator; CompType: Capacitor; PartNumber: CL05B104KP5NNNC; PackageReference: 0402; RoHS: Y; Tolerance_%: 10%; Value2: 10V; MountType: SMT; Technology: Ceramic; TempCo: X7R; Cap_Case: 0402; Published: 2008-06-19; Publisher: Texas Instruments; LatestRevisionDate: 2017-03-09; ComponentLink1Description: Datasheet link; ComponentLink1URL: http://www.samsungsem.com/kr/front/downloadcms.do?path=/kr/support/product-search/mlcc/__icsFiles/afieldfile/2014/11/05&fileName=S_CL05B104KP5NNNC.pdf; AEC Qualified: N; AEC Grade: N/A; SizeY_mm: 0.5
C29:A = CMP-0082066-1: CAP, CERM, 10 pF, 3000 V,+/- 5%, C0G/NP0, AEC-Q200 Grade 1, 1812; Manufacturer: Kemet; SizeAreaWB_mm2: 23.1; SizeArea_mm2: 14.4; AEC Qualified: Y; AEC Category: Q200; Value: 10pF; TaMax_C: 125°C; SizeZ_mm: 1.8; AEC Grade: 1; Polarized: N; TaMin_C: -55°C; SizeY_mm: 3.2; Value2: 3000V; U/M: EA; SizeX_mm: 4.5; Cap_Case: 1812; ComponentLink1Description: Datasheet link; Cap_F: 10pF; RoHS: Y; Tolerance_%: 5%; Supplier 1: Digi-Key; PackageReference: 1812; Technology: Ceramic; PartNumber: C1812C100JHGACTU; TempCo: C0G/NP0; Supplier Part Number 2: 80-C1812C100JHG; Supplier 2: Mouser; ComponentLink1URL: https://search.kemet.com/component-edge/download/datasheet/C1812C100JHGACTU.pdf; CompType: Capacitor; MountType: SMT; Supplier Part Number 1: 399-7113-1-ND
R15:A = CMP-0026825-5: as R2:A on sheet MCU063A_Emulator; CompType: Resistor; PartNumber: CRCW040210K0JNED; PackageReference: 0402; RoHS: E; Res_ohm: 10k; Tolerance_%: 5%; Value1: 5%; MountType: SMT; Technology: Thick Film; ComponentLink1Description: Datasheet link; ComponentLink1URL: http://www.vishay.com/docs/20035/dcrcwe3.pdf; Supplier 1: Digi-Key; Supplier Part Number 1: 541-10KJCT-ND; Supplier 2: Newark; Supplier Part Number 2: 59M6696; Supplier 3: Mouser; Supplier Part Number 3: 71-CRCW0402J-10K-E3; SizeY_mm: 0.5
S1:A = CMP-0002230-1: Switch, SPST, 2 Pos, 25mA, 24VDC, SMD; Manufacturer: CTS Electrocomponents; VDC_V: 24V; SwitchFunction: Off-On; PositionCount: 2; CurrentRating_mA: 25A; PartNumber: 218-2LPST; MountType: SMT; ComponentLink1Description: Datasheet Link; ComponentLink1URL: http://www.ctscorp.com/components/Datasheets/218.pdf; RoHS: Y; Orientation: Top Actuated; CompType: Switch; PackageReference: 3.71x5.8mm; Publisher: Texas Instruments; LatestRevisionDate: 2017-03-09; Supplier 1: Digi-Key; Supplier Part Number 1: CT2182LPST-ND; Supplier 2: Mouser; Supplier Part Number 2: 774-2182LPST
U5:A U6:A U8:A U9:A = CMP-0029375-1: 25 Mbps Dual Channels, 2 / 0, Digital Isolator, 3.3 V / 5 V, -40 to +125 degC, 8-pin SOIC (D), Green (RoHS & no Sb/Br); Manufacturer: Texas Instruments; Datarate(Mbps): 25; Input Noise Filter: Yes; Insulation Rating(VRMS): 2500; Prop Delay(Max)(ns): 42; Rating: Catalog; Supply Voltage(s)(V): 3.3, 5; TTL/CMOS Input Threshold: TTL; DatasheetVersion: SLLS755L; PackageVersion: revM, Jun-2011; PackageReference: D0008B; PackageDescription: 8-Pin Plastic Small Outline Integrated Circuit, 4.9 x 3.9 mm, Pitch 1.27 mm Pitch; Eco-Plan: Green (RoHS & no Sb/Br); SubFamily: Isolator; Thermal Shutdown: No; PartNumber: ISO7220CD; ComponentLink1Description: Manufacturer URL; ComponentLink1URL: http://www.ti.com/; ComponentLink2Description: Datasheet; ComponentLink2URL: http://www.ti.com/general/docs/lit/getliterature.tsp?genericPartNumber=ISO7220C&fileType=pdf; ComponentLink3Description: URL Link1; ComponentLink3URL: SamplesURL:http://www.ti.com/product/iso7220c#samples; Channel Configuration: 2/01/2000; Mounting Technology: Surface Mount
U7:A = CMP-0047070-3: Octal Buffer/Driver With 3-State OUtputs, PW0020A (TSSOP-20); Manufacturer: Texas Instruments; Bits(#): 8; F @ Nom Voltage(Max)(Mhz): 100; ICC @ Nom Voltage(Max)(mA): 0.024; Input Type: LVTTL; Rating: Catalog; tpd @ Nom Voltage(Max)(ns): 4.4,3.1,2.8; VCC(Max)(V): 3.6; VCC(Min)(V): 1.65; Voltage(Nom)(V): 1.8,2.5,2.7,3.3; AEC Category: Q200; AEC Qualified: N; CompType: IC; SizeArea_mm2: 43.56; SizeAreaWB_mm2: 73.96; SizeX_mm: 6.6; SizeZ_mm: 1.2; PackageReference: PW0020A; Code_JEDEC: MO-153; DatasheetVersion: SCES188G; Generic Part Number: SN74ALVC244; Operating Temperature Range(C): -40 to 85; Output Type: LVTTL; PackageVersion: http://www.ti.com/lit/ml/mpds362/mpds362.pdf; Alternate Manufacturer: Texas Instruments; Alternate PartNumber: SN74ALVC244PW; ComponentLink1Description: Datasheet Link; ComponentLink1URL: http://www.ti.com/lit/ds/symlink/sn74alvc244.pdf; ComponentLink2Description: Product Folder; ComponentLink2URL: http://www.ti.com/product/sn74alvc244; ComponentLink3Description: Online Datasheet; ComponentLink3URL: http://www.ti.com/product/sn74alvc244/datasheet; MountType: SMT; PackageDescription: TSSOP-20; PartNumber: SN74ALVC244PWR; RoHS: Y; SizeY_mm: 6.6

## Sheet MCU063A_EVM_Hardware.SchDoc
size 431 x 279 mm; Date: Not shown in title block; ApprovedBy: Not shown in title block; CheckedBy: Not shown in title block; Author: Not shown in title block; CompanyName: Not shown in title block; Engineer: Not shown in title block; Organization: Not shown in title block; Address1: Not shown in title block; Address2: Not shown in title block; Address3: Not shown in title block; Address4: Not shown in title block; DocumentNumber: 11; Revision: Use project parameter SCH_Rev; SheetNumber: 11; SheetTotal: 11; PageSetup: Record=PageOptions|CenterHorizontal=True|CenterVertical=True|PrintScale=1.00|XCorrection=1.00|YCorrection=1.00|PrintKind=0|BorderSize=5000000|LeftOffset=0|BottomOffset=0|Orientation=2|PaperLength=1000|PaperWidth=1000|Scale=100|PaperSource=15|PrintQuality=600|MediaType=1|DitherType=10|PaperKind=Letter|PrintScaleMode=1; CurrentTime: Not shown in title block; CurrentDate: Not shown in title block; Time: Not shown in title block; DocumentFullPathAndName: Not shown in title block; DocumentName: Not shown in title block; ModifiedDate: Not shown in title block; ImagePath: Not shown in title block
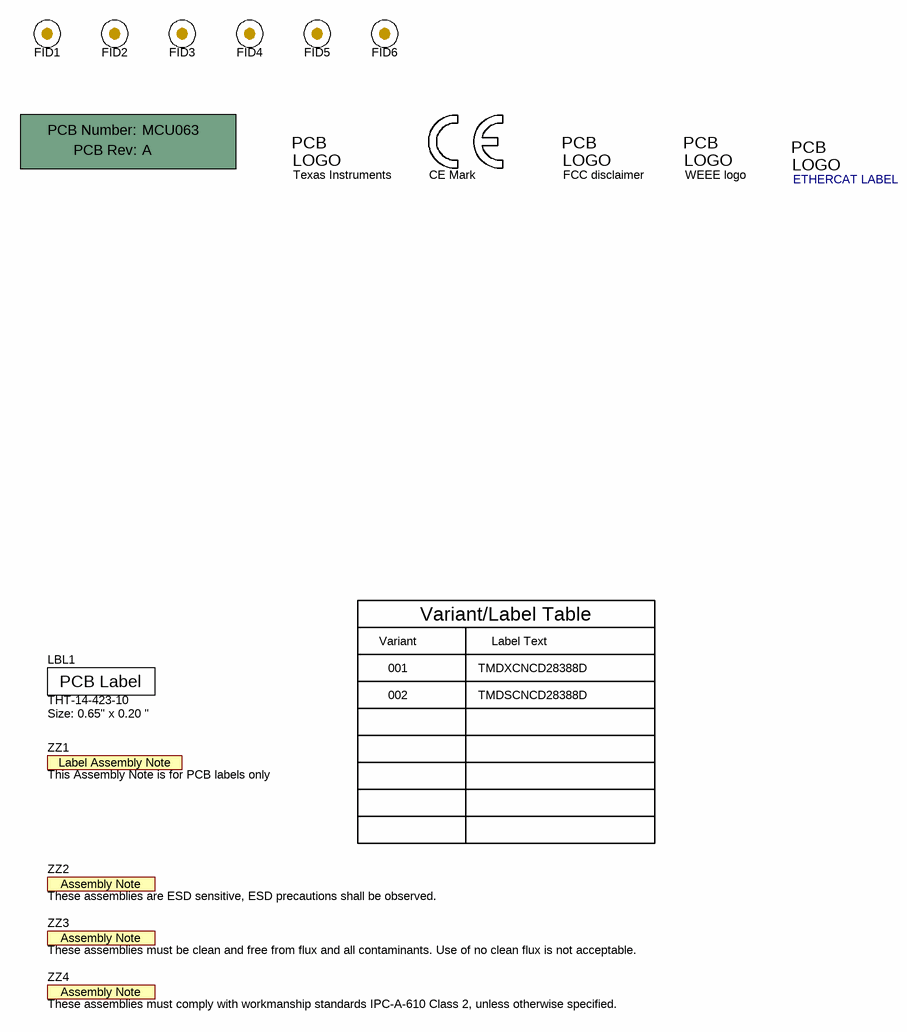
[diagram p10: MCU063A_EVM_Hardware.SchDoc]

### Parts
!PCB1  Printed Circuit Board  (value not drawn)  (mechanical)
FID1  Fiducial  [Fiducial10-20]  (value not drawn)
FID2  Fiducial  [Fiducial10-20]  (value not drawn)
FID3  Fiducial  [Fiducial10-20]  (value not drawn)
FID4  Fiducial  [Fiducial10-20]  (value not drawn)
FID5  Fiducial  [Fiducial10-20]  (value not drawn)
FID6  Fiducial  [Fiducial10-20]  (value not drawn)
LBL1  THT-14-423-10  Note: Size: 0.65" x 0.20 "  [Label_650x200]
Logo1  CE Mark  [CE_Mark_5mm]  (no BOM)
Logo2  Texas Instruments  [TI_Stacked_Overlay_Small]  (no BOM)
Logo3  FCC disclaimer  [FCC_disclaimer]  (no BOM)
Logo4  WEEE logo  [WEEE_Minimum]  (no BOM)
Logo5  ETHERCAT LABEL  [EtherCAT_label]  (no BOM)
ZZ1  This Assembly Note is for PCB labels only  [AssemblyNoteLabel]  (no BOM)
ZZ2  These assemblies are ESD sensitive, ESD precautions shall be observed.  [AssemblyNote]  (no BOM)
ZZ3  These assemblies must be clean and free from flux and all contaminants. Use of no clean flux is not acceptable.  [AssemblyNote]  (no BOM)
ZZ4  These assemblies must comply with workmanship standards IPC-A-610 Class 2, unless otherwise specified.  [AssemblyNote]  (no BOM)

### Notes on the sheet
- Variant
- Variant/Label Table
- Label Text
- 001
- 002
- TMDXCNCD28388D
- TMDSCNCD28388D
- Drawn By:
- SVN Rev:
- Number:
- TID #:
- Orderable:
- Rev:
- Sheet Title:
- File:
- Project Title:
- Designed for:
- Assembly Variant:
- Mod. Date:
- Sheet:
- Size:
- of
- B
- http://www.ti.com
- Texas Instruments and/or its licensors do not warrant the accuracy or completeness of this specification or any information contained therein. Texas Instruments and/or its licensors do not warrant that this design will meet the specifications, will be suitable for your application or fit for any particular purpose, or will operate in an implementation. Texas Instruments and/or its licensors do not warrant that the design is production worthy. You should completely validate and test your design implementation to confirm the system functionality for your application.
- Engineer:
- Contact:
- © Texas Instruments
- (in symbol CMP-0003616-3) Label Assembly Note
- (in symbol CMP-0003618-2) PCB Number:; PCB Rev:
- (in symbol CMP-0003625-1) PCB Label
- (in symbol CMP-0074769-1) PCB; LOGO
- (in symbol CMP-0074838-1) PCB; LOGO
- (in symbol CMP-0074847-1) PCB; LOGO
- (in symbol CMP-0084011-3) PCB; LOGO

### Library data of the parts
!PCB1 = CMP-0003618-2: Manufacturer: Any; PartNumber: MCU063; CompType: PCB; RoHS: O; MountType: N/A; Publisher: Texas Instruments; LatestRevisionDate: 2017-03-09; Key: PCB
FID1-FID6 = CMP-0077181-1: Fiducial mark.  There is nothing to buy or mount.; CompType: Fiducial; Manufacturer: N/A; MountType: N/A; PackageReference: N/A; PartNumber: N/A; ClassName: FiducialMark; Library Reference: Fiducial
LBL1 = CMP-0003625-1: Thermal Transfer Printable Labels, 0.650" W x 0.200" H - 10,000 per roll; Manufacturer: Brady; ClassName: Label; CompType: Label; PartNumber: THT-14-423-10; RoHS: Y; PackageReference: PCB Label 0.650 x 0.200 inch; MountType: N/A; ComponentLink1Description: Web Page; ComponentLink1URL: http://www.bradyid.com/bradyid/pdpv/THT-14-423-10.html; Publisher: Texas Instruments; LatestRevisionDate: 2017-03-09; Supplier 1: Newark; Supplier Part Number 1: 97C5133; Supplier 2: Farnell; Supplier Part Number 2: 2065596; Key: THT-14-423-10
Logo1 = CMP-0074844-1: SymbolCreator: a0412235; Published: 2009-03-03; Publisher: Texas Instruments; LatestRevisionDate: 2017-07-06; Lib Reference: CE Mark; PartNumber: CE Mark; Library Reference: CE Mark
Logo2 = CMP-0074838-1: Texas Instrument Corporate Signature; SymbolCreator: a0412235; Lib Reference: TI_Logo; Library Reference: Logo; SymbolVersion: 2011-08-22; Published: 2009-03-03; Publisher: Texas Instruments; ClassName: Logo; LatestRevisionDate: 2017-07-06; PartNumber: Texas Instruments
Logo3 = CMP-0074847-1: FCC_disclaimer; Published: 2009-03-03; Publisher: Texas Instruments; LatestRevisionDate: 2017-07-06; Lib Reference: FCC_disclaimer; PartNumber: FCC disclaimer; Library Reference: Logo
Logo4 = CMP-0074769-1: Library Reference: WEEE logo; Lib Reference: WEEE logo; PartNumber: WEEE logo
Logo5 = CMP-0084011-3: EtherCAT logo; Publisher: Texas Instruments; LatestRevisionDate: 2018-07-27; Lib Reference: ETHERCAT LABEL; Library Reference: Logo; Published: 2009-03-03; ClassName: Logo
ZZ1 = CMP-0003616-3: CompType: AssemblyNote; ClassName: AssemblyNote; Publisher: Texas Instruments; LatestRevisionDate: 2017-03-09; Key: AssemblyNoteLabel
ZZ2 = CMP-0077236-1: CompType: AssemblyNote; ClassName: AssemblyNote; Publisher: Texas Instruments; LatestRevisionDate: 2017-08-10; Key: AssemblyNote
ZZ3 = CMP-0077237-1: CompType: AssemblyNote; ClassName: AssemblyNote; Publisher: Texas Instruments; LatestRevisionDate: 2017-08-10; Key: AssemblyNote
ZZ4 = CMP-0077238-1: CompType: AssemblyNote; ClassName: AssemblyNote; Publisher: Texas Instruments; LatestRevisionDate: 2017-08-10; Key: AssemblyNote

## Nets that join several sheets
EMU_3V3: MCU063A_Emulator (21 pins), MCU063A_Emulator_interface (8 pins)
EMU_GND: MCU063A_Emulator (42 pins), MCU063A_Emulator_interface (10 pins)
GND: MCU063A_GPIO (15 pins), MCU063A_Support (32 pins), MCU063A_ADC (49 pins), MCU063A_Power (119 pins), MCU063A_USB (11 pins), MCU063A_EtherNET (19 pins), MCU063A_EtherCAT (59 pins), MCU063A_Emulator_interface (15 pins)
HSEC_5V0: MCU063A_GPIO (6 pins), MCU063A_Power (D3.2 TP7.1)
USB_5V0: MCU063A_Power (R79.2), MCU063A_USB (5 pins)
VDD_1V2: MCU063A_Support (U4.3), MCU063A_Power (24 pins)
VDD_3V3: MCU063A_GPIO (R1.2 R2.1), MCU063A_Support (26 pins), MCU063A_Power (51 pins), MCU063A_USB (R100.1), MCU063A_EtherNET (30 pins), MCU063A_EtherCAT (73 pins), MCU063A_Emulator_interface (11 pins)
VDDA_3V3: MCU063A_ADC (18 pins), MCU063A_Power (6 pins)
ADC_A0A1_N: MCU063A_GPIO (EC1.11), MCU063A_ADC (R49.2)
ADC_A0A1_P: MCU063A_GPIO (EC1.9), MCU063A_ADC (R48.2)
ADC_A2A3_N: MCU063A_GPIO (EC1.17), MCU063A_ADC (R51.2)
ADC_A2A3_P: MCU063A_GPIO (EC1.15), MCU063A_ADC (R50.2)
ADC_A4A5_N: MCU063A_GPIO (EC1.23), MCU063A_ADC (R53.2)
ADC_A4A5_P: MCU063A_GPIO (EC1.21), MCU063A_ADC (R52.2)
ADC_B0B1_N: MCU063A_GPIO (EC1.14), MCU063A_ADC (R58.2)
ADC_B0B1_P: MCU063A_GPIO (EC1.12), MCU063A_ADC (R57.2)
ADC_B2B3_N: MCU063A_GPIO (EC1.20), MCU063A_ADC (R60.2)
ADC_B2B3_P: MCU063A_GPIO (EC1.18), MCU063A_ADC (R59.2)
ADC_B4B5_N: MCU063A_GPIO (EC1.26), MCU063A_ADC (R62.2)
ADC_B4B5_P: MCU063A_GPIO (EC1.24), MCU063A_ADC (R61.2)
ADC_C2C3_N: MCU063A_GPIO (EC1.33), MCU063A_ADC (R65.2)
ADC_C2C3_P: MCU063A_GPIO (EC1.31), MCU063A_ADC (R64.2)
ADC_C4C5_N: MCU063A_GPIO (EC1.39), MCU063A_ADC (R67.2)
ADC_C4C5_P: MCU063A_GPIO (EC1.37), MCU063A_ADC (R66.2)
ADC_D0D1_N: MCU063A_GPIO (EC1.30), MCU063A_ADC (R70.2)
ADC_D0D1_P: MCU063A_GPIO (EC1.28), MCU063A_ADC (R69.2)
ADC_D2D3_N: MCU063A_GPIO (EC1.36), MCU063A_ADC (R72.2)
ADC_D2D3_P: MCU063A_GPIO (EC1.34), MCU063A_ADC (R71.2)
ADC_D4D5_N: MCU063A_GPIO (EC1.42), MCU063A_ADC (R78.2)
ADC_D4D5_P: MCU063A_GPIO (EC1.40), MCU063A_ADC (R73.2)
ADC_IN1415_N: MCU063A_GPIO (EC1.27), MCU063A_ADC (R56.2)
ADC_IN1415_P: MCU063A_GPIO (EC1.25), MCU063A_ADC (R55.2)
EMU_SCI-RX: MCU063A_Emulator (U2:A.38), MCU063A_Emulator_interface (U9:A.2)
EMU_SCI-TX: MCU063A_Emulator (U2:A.39), MCU063A_Emulator_interface (U8:A.6)
EMU_TCK: MCU063A_Emulator (R3:A.1 U2:A.16), MCU063A_Emulator_interface (U6:A.2)
EMU_TDI: MCU063A_Emulator (U2:A.17), MCU063A_Emulator_interface (U5:A.2)
EMU_TDO: MCU063A_Emulator (U2:A.18), MCU063A_Emulator_interface (U8:A.7)
EMU_TMS: MCU063A_Emulator (R2:A.1 U2:A.19), MCU063A_Emulator_interface (U6:A.3)
EMU_TRSTn: MCU063A_Emulator (U2:A.21), MCU063A_Emulator_interface (U5:A.3)
ENET_PHY_CLK: MCU063A_Support (R34.2), MCU063A_EtherNET (U17.23)
HSEC_ADC-VREFHI: MCU063A_GPIO (EC1.45), MCU063A_ADC (R44.1)
HSEC_GPIO8: MCU063A_GPIO (EC1.57), MCU063A_Support (R19.2)
HSEC_GPIO9: MCU063A_GPIO (EC1.59), MCU063A_Support (R21.2)
HSEC_GPIO26: MCU063A_GPIO (EC1.79), MCU063A_Support (R22.2)
HSEC_GPIO27: MCU063A_GPIO (EC1.81), MCU063A_Support (R23.2)
MCU_GPIO8: MCU063A_GPIO (U1.G2), MCU063A_Support (J2.1 R19.1)
MCU_GPIO9: MCU063A_GPIO (U1.G3), MCU063A_Support (J2.3 R21.1)
MCU_GPIO26: MCU063A_GPIO (U1.K1), MCU063A_Support (J2.5 R22.1)
MCU_GPIO27: MCU063A_GPIO (U1.L1), MCU063A_Support (J2.7 R23.1)
MCU_GPIO28: MCU063A_GPIO (EC1.76 U1.V11), MCU063A_Emulator_interface (S1:A.3)
MCU_GPIO29: MCU063A_GPIO (EC1.78 U1.W11), MCU063A_Emulator_interface (U8:A.3)
MCU_GPIO31: MCU063A_GPIO (EC1.82 U1.U11), MCU063A_Support (R11.1 U2.1)
MCU_GPIO34: MCU063A_GPIO (EC1.86 U1.U14), MCU063A_Support (R12.1 U2.3)
MCU_GPIO42: MCU063A_GPIO (U1.D19), MCU063A_USB (R91.1)
MCU_GPIO43: MCU063A_GPIO (U1.C19), MCU063A_USB (R92.1)
MCU_GPIO44: MCU063A_GPIO (U1.K18), MCU063A_EtherNET (U17.2)
MCU_GPIO46: MCU063A_GPIO (U1.E19), MCU063A_USB (R94.1 R96.2)
MCU_GPIO47: MCU063A_GPIO (U1.E18), MCU063A_USB (R97.1)
MCU_GPIO72: MCU063A_GPIO (EC2.139 R8.1), MCU063A_Support (R24.2 S2.2)
MCU_GPIO75: MCU063A_GPIO (U1.D16), MCU063A_EtherNET (U17.4)
MCU_GPIO84: MCU063A_GPIO (EC2.151 U1.A11), MCU063A_Support (R25.1 S2.1)
MCU_GPIO100: MCU063A_GPIO (U1.H1), MCU063A_Support (J1.3)
MCU_GPIO101: MCU063A_GPIO (U1.H2), MCU063A_Support (J1.7)
MCU_GPIO102: MCU063A_GPIO (U1.H3), MCU063A_Support (J1.5)
MCU_GPIO103: MCU063A_GPIO (U1.J1), MCU063A_Support (J1.2 R13.1)
MCU_GPIO105: MCU063A_GPIO (U1.J3), MCU063A_EtherNET (U17.20)
MCU_GPIO106: MCU063A_GPIO (U1.L2), MCU063A_EtherNET (R108.2 U17.19)
MCU_GPIO107: MCU063A_GPIO (EC2.170 U1.L3), MCU063A_Support (R27.2)
MCU_GPIO108: MCU063A_GPIO (U1.L4), MCU063A_EtherNET (R109.1 U17.8)
MCU_GPIO109: MCU063A_GPIO (U1.N2), MCU063A_EtherNET (U17.27)
MCU_GPIO110: MCU063A_GPIO (U1.M2), MCU063A_EtherNET (U17.29)
MCU_GPIO111: MCU063A_GPIO (U1.M4), MCU063A_EtherNET (U17.25)
MCU_GPIO112: MCU063A_GPIO (U1.M3), MCU063A_EtherNET (U17.26)
MCU_GPIO113: MCU063A_GPIO (U1.N4), MCU063A_EtherNET (U17.28)
MCU_GPIO114: MCU063A_GPIO (U1.N3), MCU063A_EtherNET (U17.30)
MCU_GPIO115: MCU063A_GPIO (U1.V12), MCU063A_EtherNET (U17.31)
MCU_GPIO116: MCU063A_GPIO (U1.W10), MCU063A_EtherNET (U17.32)
MCU_GPIO117: MCU063A_GPIO (U1.U12), MCU063A_EtherNET (U17.1)
MCU_GPIO118: MCU063A_GPIO (U1.T12), MCU063A_EtherNET (U17.3)
MCU_GPIO119: MCU063A_GPIO (U1.T15), MCU063A_EtherNET (U17.18)
MCU_GPIO120: MCU063A_GPIO (U1.U15), MCU063A_USB (R93.1)
MCU_GPIO121: MCU063A_GPIO (U1.W16), MCU063A_USB (R95.1)
MCU_GPIO122: MCU063A_GPIO (U1.T8), MCU063A_EtherNET (U17.5)
MCU_GPIO123: MCU063A_GPIO (U1.U8), MCU063A_EtherNET (U17.6)
MCU_GPIO124: MCU063A_GPIO (U1.V8), MCU063A_EtherNET (U17.7)
MCU_GPIO129: MCU063A_GPIO (U1.T10), MCU063A_EtherCAT (U21.3)
MCU_GPIO130: MCU063A_GPIO (U1.U10), MCU063A_EtherCAT (U21.2)
MCU_GPIO131: MCU063A_GPIO (U1.V10), MCU063A_EtherCAT (U21.4)
MCU_GPIO132: MCU063A_GPIO (U1.W18), MCU063A_EtherCAT (U21.5)
MCU_GPIO134: MCU063A_GPIO (U1.V18), MCU063A_EtherCAT (U21.6)
MCU_GPIO135: MCU063A_GPIO (U1.U18), MCU063A_EtherCAT (U21.7)
MCU_GPIO136: MCU063A_GPIO (U1.T17), MCU063A_EtherCAT (R151.2 U21.26)
MCU_GPIO137: MCU063A_GPIO (U1.T18), MCU063A_EtherCAT (U21.25)
MCU_GPIO138: MCU063A_GPIO (U1.T19), MCU063A_EtherCAT (R143.1 U21.28)
MCU_GPIO139: MCU063A_GPIO (U1.N19), MCU063A_EtherCAT (R152.2 U21.30)
MCU_GPIO140: MCU063A_GPIO (U1.M19), MCU063A_EtherCAT (R153.2 U21.31)
MCU_GPIO141: MCU063A_GPIO (U1.M18), MCU063A_EtherCAT (R154.2 U21.32)
MCU_GPIO142: MCU063A_GPIO (U1.L19), MCU063A_EtherCAT (R155.2 U21.1)
MCU_GPIO143: MCU063A_GPIO (U1.F18), MCU063A_EtherCAT (J5.11)
MCU_GPIO144: MCU063A_GPIO (U1.F17), MCU063A_EtherCAT (J6.11)
MCU_GPIO145: MCU063A_GPIO (U1.E17), MCU063A_EtherCAT (R139.1 U20.1)
MCU_GPIO146: MCU063A_GPIO (U1.D18), MCU063A_EtherCAT (R140.1 U20.3)
MCU_GPIO148: MCU063A_GPIO (U1.D14), MCU063A_EtherCAT (J5.2 R133.1 U19.17)
MCU_GPIO149: MCU063A_GPIO (U1.A13), MCU063A_EtherCAT (J6.2 R156.1 U21.17)
MCU_GPIO150: MCU063A_GPIO (U1.B13), MCU063A_EtherCAT (R116.1 U18.5)
MCU_GPIO151: MCU063A_GPIO (U1.C13), MCU063A_EtherCAT (R117.1 U18.6)
MCU_GPIO152: MCU063A_GPIO (U1.D13), MCU063A_EtherCAT (U19.20 U21.20)
MCU_GPIO153: MCU063A_GPIO (U1.A12), MCU063A_EtherCAT (R123.2 R148.2 U19.19 U21.19)
MCU_GPIO154: MCU063A_GPIO (U1.B12), MCU063A_Support (R28.1 R32.1)
MCU_GPIO155: MCU063A_GPIO (U1.C12), MCU063A_EtherCAT (U19.18 U21.18)
MCU_GPIO156: MCU063A_GPIO (U1.D12), MCU063A_EtherCAT (U19.3)
MCU_GPIO157: MCU063A_GPIO (U1.B10), MCU063A_EtherCAT (U19.2)
MCU_GPIO158: MCU063A_GPIO (U1.C10), MCU063A_EtherCAT (U19.4)
MCU_GPIO159: MCU063A_GPIO (U1.D10), MCU063A_EtherCAT (U19.5)
MCU_GPIO160: MCU063A_GPIO (U1.B9), MCU063A_EtherCAT (U19.6)
MCU_GPIO161: MCU063A_GPIO (U1.C9), MCU063A_EtherCAT (U19.7)
MCU_GPIO162: MCU063A_GPIO (U1.D9), MCU063A_EtherCAT (R127.2 U19.26)
MCU_GPIO163: MCU063A_GPIO (U1.A8), MCU063A_EtherCAT (U19.25)
MCU_GPIO164: MCU063A_GPIO (U1.B8), MCU063A_EtherCAT (R118.1 U19.28)
MCU_GPIO165: MCU063A_GPIO (U1.C5), MCU063A_EtherCAT (R128.2 U19.30)
MCU_GPIO166: MCU063A_GPIO (U1.D5), MCU063A_EtherCAT (R129.2 U19.31)
MCU_GPIO167: MCU063A_GPIO (U1.C4), MCU063A_EtherCAT (R130.2 U19.32)
MCU_GPIO168: MCU063A_GPIO (U1.D4), MCU063A_EtherCAT (R131.2 U19.1)
MCU_TCK: MCU063A_GPIO (EC1.5), MCU063A_Support (U1.V15), MCU063A_Emulator_interface (U7:A.14)
MCU_TDI: MCU063A_GPIO (EC1.8), MCU063A_Support (U1.W13), MCU063A_Emulator_interface (U7:A.18)
MCU_TDO: MCU063A_GPIO (EC1.6), MCU063A_Support (R15.1), MCU063A_Emulator_interface (U7:A.11)
MCU_TMS: MCU063A_GPIO (EC1.3), MCU063A_Support (U1.W14), MCU063A_Emulator_interface (U7:A.12)
MCU_TRSTn: MCU063A_GPIO (EC1.4), MCU063A_Support (R16.2 U1.V14), MCU063A_Emulator_interface (U7:A.16)
MCU_XRSn: MCU063A_GPIO (EC1.120), MCU063A_Support (7 pins)
P0_PHY_CLK: MCU063A_Support (R28.2 R31.1 TP4.1), MCU063A_EtherCAT (U19.23)
P1_PHY_CLK: MCU063A_Support (R32.2 R33.1 TP5.1), MCU063A_EtherCAT (U21.23)

## Assembly variants
001: not fitted C16 C17 C17:A C18 C19 C20 C21 C22 C23 C24 C25 C26 C27 C32 C33 C34 C35 C36 C37 C38 C39 C40 C41 C42 C43 C49 C84 C86 FID1 FID2 FID3 FID4 FID5 FID6 R12:A R14:A R17 R27 R28 R32 R38 R40 R42 R43 R44 R88
002: not fitted C16 C17 C17:A C18 C19 C20 C21 C22 C23 C24 C25 C26 C27 C32 C33 C34 C35 C36 C37 C38 C39 C40 C41 C42 C43 C49 C84 C86 FID1 FID2 FID3 FID4 FID5 FID6 R12:A R14:A R17 R27 R28 R32 R38 R40 R42 R43 R44 R88